# EAGLE design untitled (EAGLE 7.2.0)
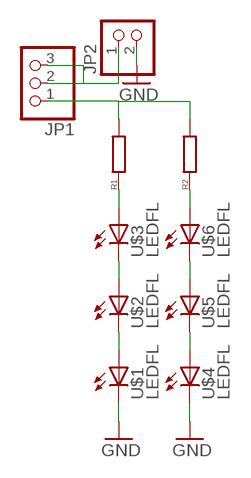
[diagram p0: schematic, sheet 1]

## Parts
JP1  PINHD-1X03_2.54-SMD-90°  [1X03SMD/90]
JP2  PINHD-1X02_2.54-SMD-90°  [1X02SMD/90]
R1  R0805  [R0805]
R2  R0805  [R0805]
U$1  LEDFL  [LED1]
U$2  LEDFL  [LED1]
U$3  LEDFL  [LED1]
U$4  LEDFL  [LED1]
U$5  LEDFL  [LED1]
U$6  LEDFL  [LED1]

## Nets
GND: JP2.2 U$1.P$2(C) U$4.P$2(C)
N$1: U$1.P$1(A) U$2.P$2(C)
N$2: U$2.P$1(A) U$3.P$2(C)
N$3: U$4.P$1(A) U$5.P$2(C)
N$4: U$5.P$1(A) U$6.P$2(C)
N$5: R1.1 U$3.P$1(A)
N$6: R2.1 U$6.P$1(A)
N$7: JP1.1 R1.2 R2.2
N$9: JP1.2 JP1.3 JP2.1

## Library data of the parts
JP1 = pinhead-2:PINHD-1X03: PIN HEADER
JP2 = pinhead-2:PINHD-1X02: PIN HEADER
R1 R2 = smalsmd:R
U$1-U$6 = smalsmd:LED

## Board
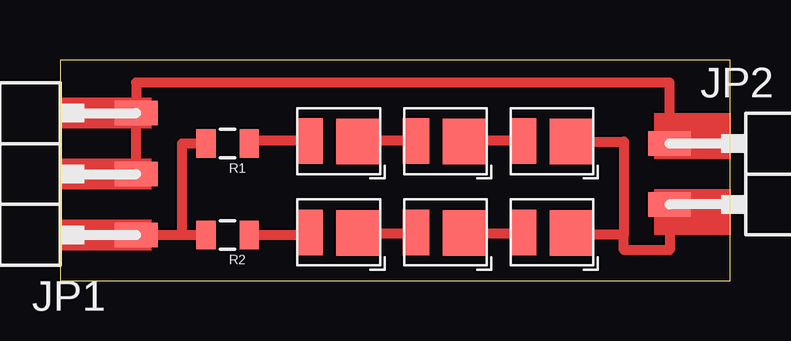
[diagram p1: board, top side]

Size 27.92 x 9.2 mm. Coordinates in mm from the lower left corner, seen from the top.
Outline: 0,0 27.92,0 27.92,9.2 0,9.2 0,0
Copper layers (1*16): Top 0.035mm / dielectric 1.5mm / Bottom 0.035mm
Design rules "default": minimum track width 0.2mm, minimum drill 0.2mm, track to track 0.2mm, track to pad 0.2mm, pad to pad 0.2mm, via to via 0.2mm, smd to smd 0.2mm, copper to edge 0.2mm, drill to drill 0.2mm, minimum pad ring 10mil, minimum via ring 8mil, stop-mask expansion 4mil, vias tented up to drill 0mil, thermal gap 10mil

### Footprints (pad centres in the part's own frame; a part is rotated, then mirrored left to right if it is on the bottom)
1X03SMD/90 = smd 1.016 x 1.778: 1 -1.27,-5.08; 2 1.27,-5.08; 3 3.81,-5.08
1X02SMD/90 = smd 1.016 x 1.778: 1 -1.27,-5.08; 2 1.27,-5.08
R0805 = smd 0.8 x 1.2: 1 -0.9,0; 2 0.9,0
LED1 = smd 1.9 x 1.1: P$1 1.38,2.94 | smd 1.9 x 1.85: P$2 1.35,0.9

### Placement (x,y rotation side)
JP1  -1.91,3.17 90 top
JP2  30.48,4.45 270 top
R1  6.99,5.71 180 top
R2  6.99,1.91 180 top
U$1  22.23,4.45 90 top
U$2  17.78,4.45 90 top
U$3  13.34,4.45 90 top
U$4  22.23,0.64 90 top
U$5  17.78,0.64 90 top
U$6  13.34,0.64 90 top

### Tracks (layer width: path | path; a pad name or v marks a point on that pad's centre or on a via)
GND
  Top 0.406: 23.5,1.91 21.32,1.91 U$4.P$2 | U$1.P$2 23.5,5.79 23.5,1.91 | JP2.2 25.4,1.27 23.5,1.27 23.5,1.91
N$1
  Top 0.406: U$1.P$1 16.88,5.83 U$2.P$2
N$2
  Top 0.406: U$2.P$1 12.44,5.83 U$3.P$2
N$3
  Top 0.406: U$5.P$2 19.29,1.99 U$4.P$1
N$4
  Top 0.406: U$6.P$2 14.84,1.99 U$5.P$1
N$5
  Top 0.406: U$3.P$1 7.88,5.83 R1.1
N$6
  Top 0.406: R2.1 10.39,1.91 U$6.P$1
N$7
  Top 0.406: R1.2 5.08,5.71 5.08,1.91 | 5.08,1.91 R2.2 | JP1.1 5.08,1.91
N$9
  Top 0.406: JP1.2 JP1.3 3.17,8.26 25.4,8.26 JP2.1
(copper drawn outside any net)
  shapes: Top area x5